# EAGLE schematic amebot2_motors (EAGLE 6.5.0)
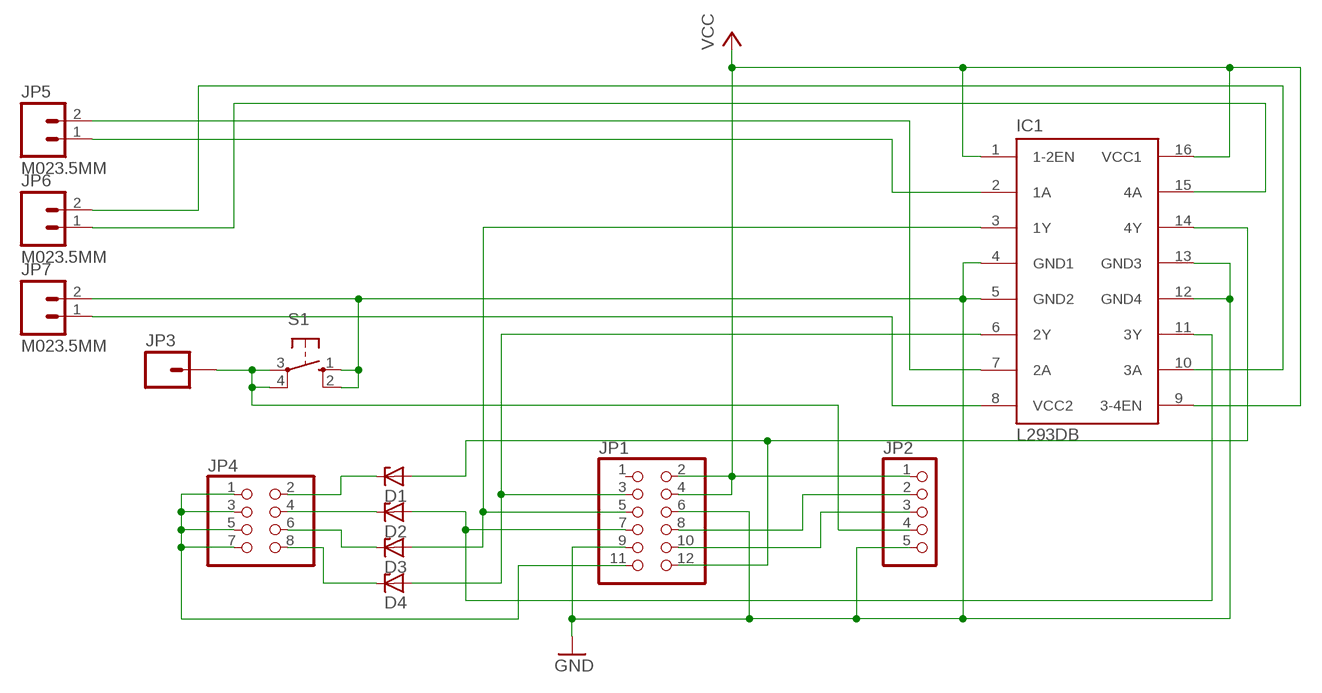
[diagram p0: schematic, sheet 1]

## Parts
D1  ZENER-DIODEZD-7.5  [ZDIO-7.5]
D2  ZENER-DIODEZD-7.5  [ZDIO-7.5]
D3  ZENER-DIODEZD-7.5  [ZDIO-7.5]
D4  ZENER-DIODEZD-7.5  [ZDIO-7.5]
IC1  L293DB  [DIL16VAR]
JP1  PINHD-2X6  [2X06]
JP2  PINHD-1X5  [1X05]
JP3  M01PTH_LONGPAD  [1X01_LONGPAD]
JP4  PINHD-2X4  [2X04]
JP5  M023.5MM  [SCREWTERMINAL-3.5MM-2]
JP6  M023.5MM  [SCREWTERMINAL-3.5MM-2]
JP7  M023.5MM  [SCREWTERMINAL-3.5MM-2]
S1  10-XX  [B3F-10XX]

## Nets
GND: IC1.4(GND1) IC1.5(GND2) IC1.12(GND4) IC1.13(GND3) JP1.6 JP1.9 JP2.5 JP7.2 S1.1(S) S1.2(S1)
N$1: D1.C JP4.2
N$2: JP2.4 JP3.1 S1.3(P) S1.4(P1)
N$3: D4.A IC1.6(2Y) JP1.3
N$4: D3.A IC1.3(1Y) JP1.5
N$5: JP1.11 JP4.1 JP4.3 JP4.5 JP4.7
N$6: D1.A IC1.14(4Y) JP1.12
N$7: JP1.8 JP2.2
N$8: IC1.2(1A) JP5.1
N$9: IC1.7(2A) JP5.2
N$10: IC1.15(4A) JP6.1
N$11: IC1.10(3A) JP6.2
N$12: IC1.8(VCC2) JP7.1
N$13: JP1.10 JP2.3
N$14: D2.A IC1.11(3Y) JP1.7
N$15: D2.C JP4.4
N$16: D3.C JP4.6
N$17: D4.C JP4.8
VCC: IC1.1(1-2EN) IC1.9(3-4EN) IC1.16(VCC1) JP1.2 JP1.4 JP2.1
Unconnected: JP1.1

## Library data of the parts
D1-D4 = diode:ZENER-DIODE: Z-Diode
IC1 = st-microelectronics:L293D: PUSH-PULL 4 CHANNEL DRIVER
JP1 = pinhead:PINHD-2X6: PIN HEADER
JP2 = pinhead:PINHD-1X5: PIN HEADER
JP3 = SparkFun-Connectors:M01: Header 1 Standard 1-pin 0.1" header. Use with straight break away headers (SKU : PRT-00116), right angle break away headers (PRT-00553), swiss pins (PRT-00743), machine pins (PRT-00117), and female headers (PRT-00115).
JP4 = pinhead:PINHD-2X4: PIN HEADER
JP5-JP7 = SparkFun-Connectors:M02: Standard 2-pin 0.1" header. Use with - straight break away headers ( PRT-00116) - right angle break away headers (PRT-00553) - swiss pins (PRT-00743) - machine pins (PRT-00117) - female headers (PRT-00115) Molex polarized connector foot print use with: PRT-08233 with associated crimp pins and housings. 2.54_SCREWTERM for use with PRT-10571. 3.5mm Screw Terminal footprints for PRT-08084 5mm Screw Terminal footprints for use with PRT-08432
S1 = switch-omron:10-XX: OMRON SWITCH; MPN: B3F-1000; OC_FARNELL: 176432; OC_NEWARK: 36M3542